# Altium schematic sheet [04] - FPGA - DDR3, DDR3 MEM.SchDoc
size A2; SheetNumber: 4; SheetTotal: 4
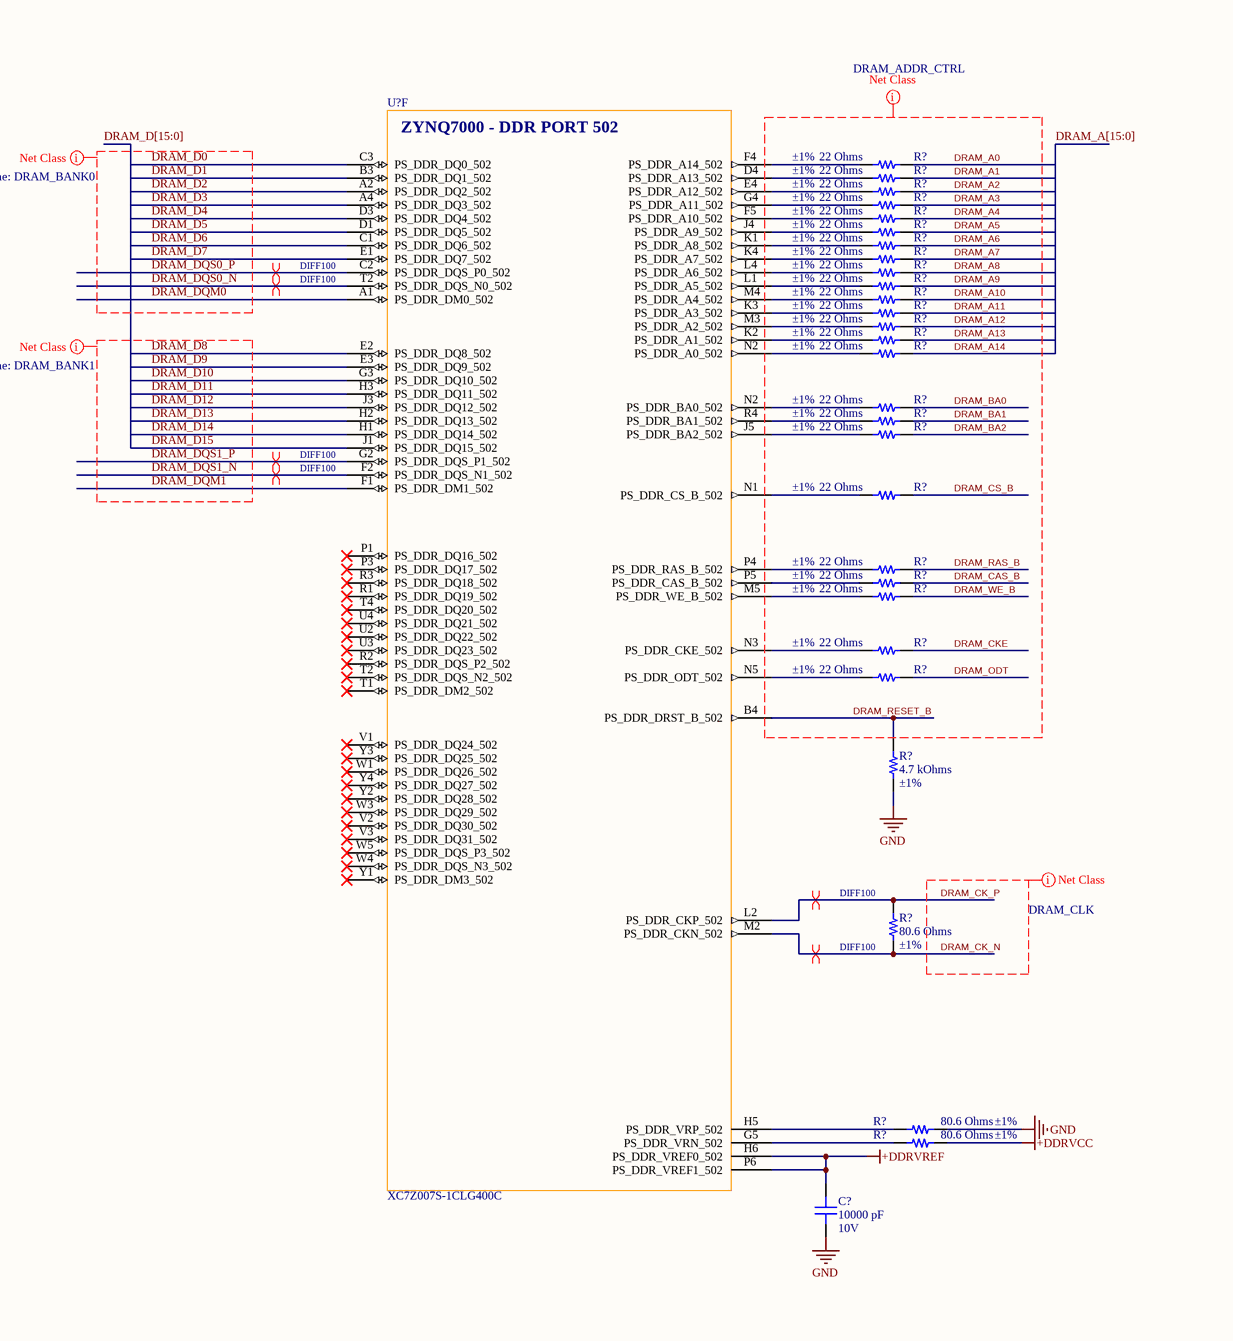
[diagram p0: [04] - FPGA - DDR3, DDR3 MEM.SchDoc, left]
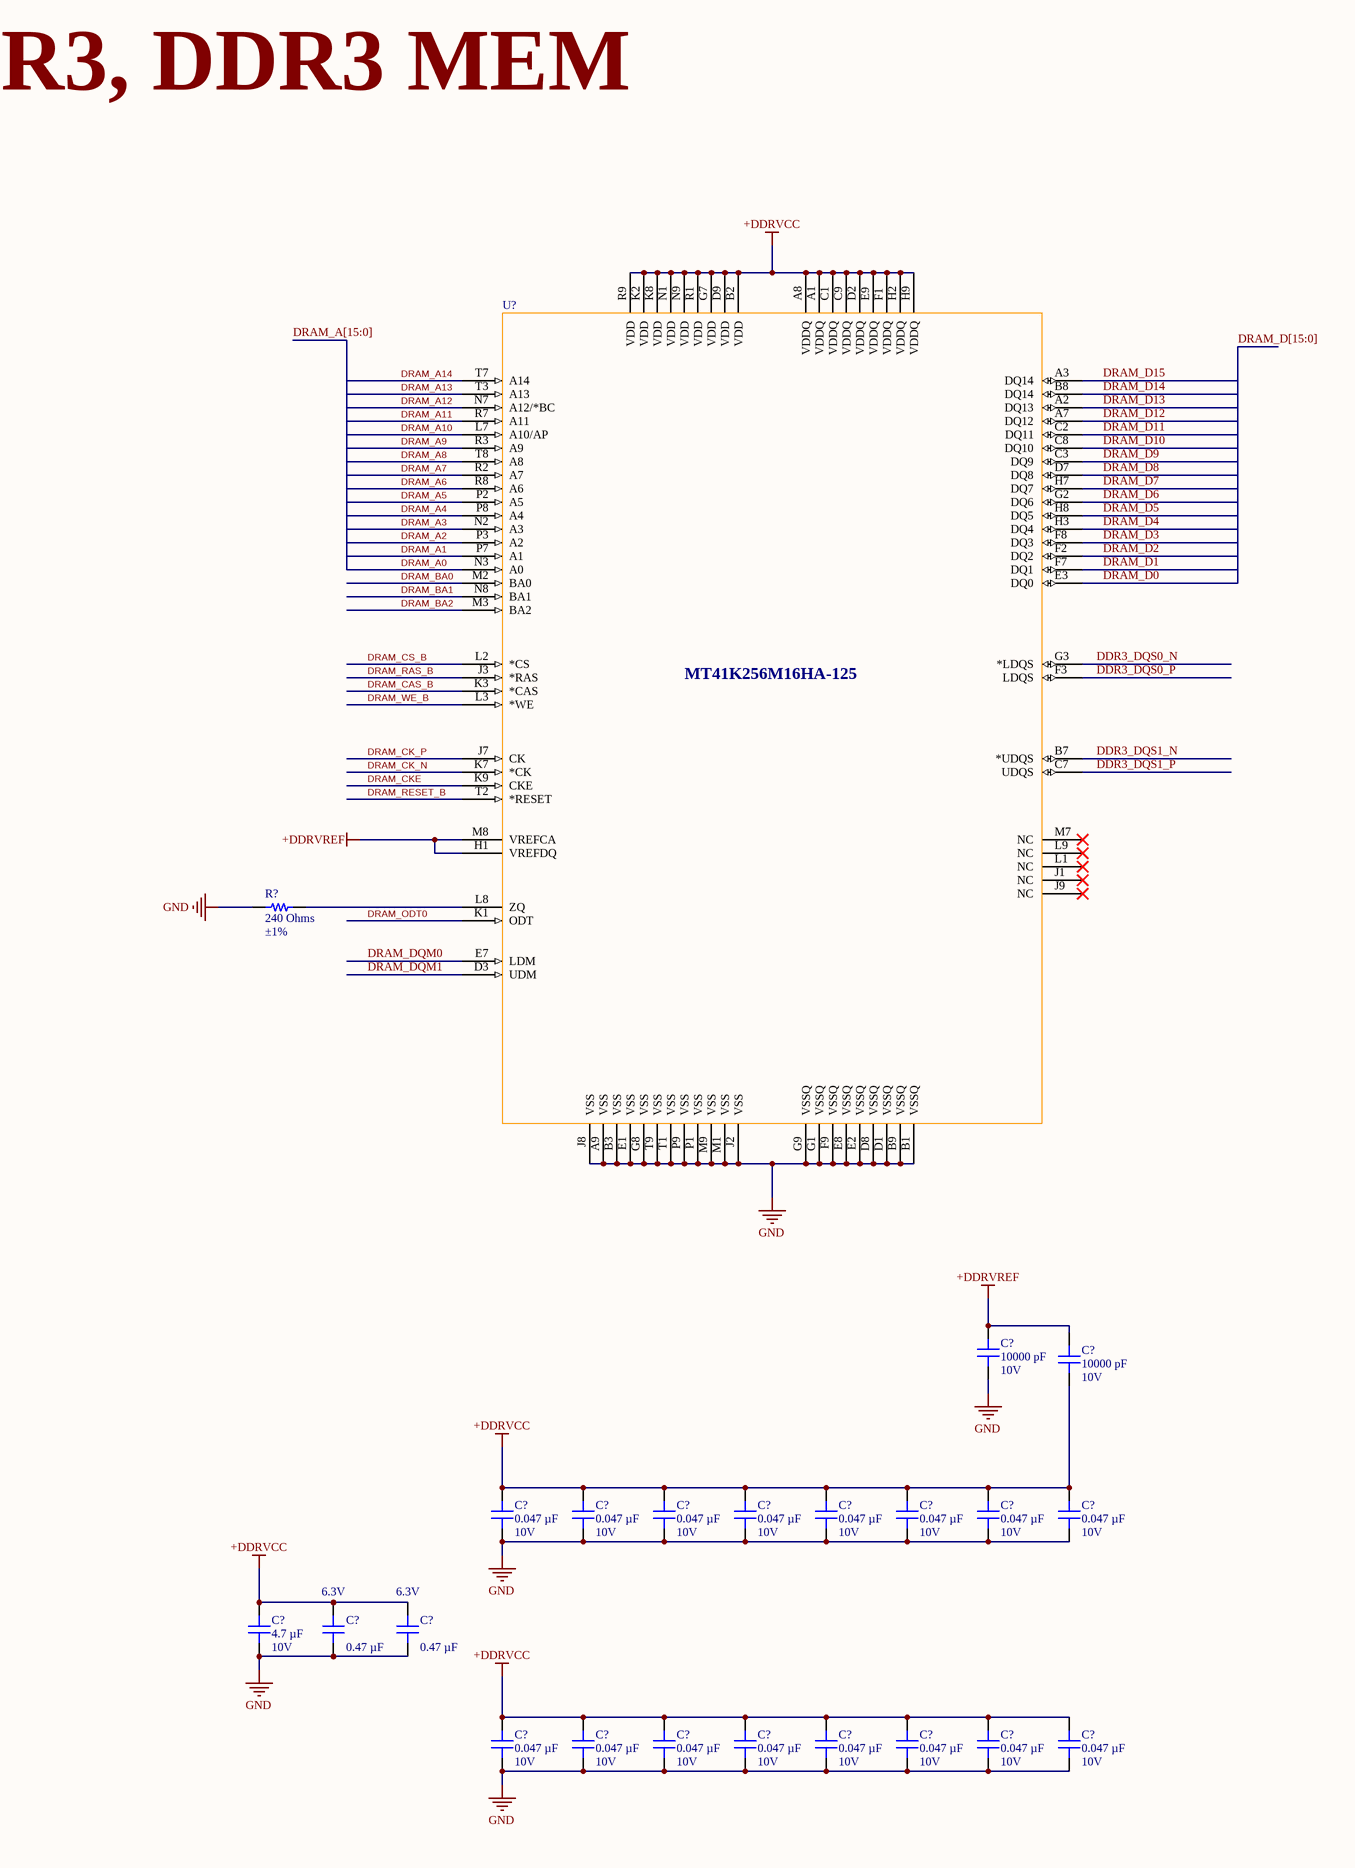
[diagram p1: [04] - FPGA - DDR3, DDR3 MEM.SchDoc, right]

## Parts
(Parts that share a designator on the sheet are numbered #1, #2 ... from top to bottom, then left to right.)
C?#1  Voltage - Rated: 10V  [CAP 0201_0603]  (hidden comment: 10000 pF)
C?#2  Voltage - Rated: 10V  [CAP 0201_0603]  (hidden comment: 10000 pF)
C?#3  Voltage - Rated: 10V  [CAP 0201_0603]  (hidden comment: 10000 pF)
C?#4  Voltage - Rated: 10V  [CAP 0201_0603]  (hidden comment: 0.047 µF)
C?#5  Voltage - Rated: 10V  [CAP 0201_0603]  (hidden comment: 0.047 µF)
C?#6  Voltage - Rated: 10V  [CAP 0201_0603]  (hidden comment: 0.047 µF)
C?#7  Voltage - Rated: 10V  [CAP 0201_0603]  (hidden comment: 0.047 µF)
C?#8  Voltage - Rated: 10V  [CAP 0201_0603]  (hidden comment: 0.047 µF)
C?#9  Voltage - Rated: 10V  [CAP 0201_0603]  (hidden comment: 0.047 µF)
C?#10  Voltage - Rated: 10V  [CAP 0201_0603]  (hidden comment: 0.047 µF)
C?#11  Voltage - Rated: 10V  [CAP 0201_0603]  (hidden comment: 0.047 µF)
C?#12  Voltage - Rated: 10V  [CAP 0402_1005]  (hidden comment: 4.7 µF)
C?#13  Voltage - Rated: 6.3V  [CAP 0201_0603]  (hidden comment: 0.47 µF)
C?#14  Voltage - Rated: 6.3V  [CAP 0201_0603]  (hidden comment: 0.47 µF)
C?#15  Voltage - Rated: 10V  [CAP 0201_0603]  (hidden comment: 0.047 µF)
C?#16  Voltage - Rated: 10V  [CAP 0201_0603]  (hidden comment: 0.047 µF)
C?#17  Voltage - Rated: 10V  [CAP 0201_0603]  (hidden comment: 0.047 µF)
C?#18  Voltage - Rated: 10V  [CAP 0201_0603]  (hidden comment: 0.047 µF)
C?#19  Voltage - Rated: 10V  [CAP 0201_0603]  (hidden comment: 0.047 µF)
C?#20  Voltage - Rated: 10V  [CAP 0201_0603]  (hidden comment: 0.047 µF)
C?#21  Voltage - Rated: 10V  [CAP 0201_0603]  (hidden comment: 0.047 µF)
C?#22  Voltage - Rated: 10V  [CAP 0201_0603]  (hidden comment: 0.047 µF)
R?#1  Tolerance: ±1%  [RES 0201_0603]  (hidden comment: 22 Ohms)
R?#2  Tolerance: ±1%  [RES 0201_0603]  (hidden comment: 22 Ohms)
R?#3  Tolerance: ±1%  [RES 0201_0603]  (hidden comment: 22 Ohms)
R?#4  Tolerance: ±1%  [RES 0201_0603]  (hidden comment: 22 Ohms)
R?#5  Tolerance: ±1%  [RES 0201_0603]  (hidden comment: 22 Ohms)
R?#6  Tolerance: ±1%  [RES 0201_0603]  (hidden comment: 22 Ohms)
R?#7  Tolerance: ±1%  [RES 0201_0603]  (hidden comment: 22 Ohms)
R?#8  Tolerance: ±1%  [RES 0201_0603]  (hidden comment: 22 Ohms)
R?#9  Tolerance: ±1%  [RES 0201_0603]  (hidden comment: 22 Ohms)
R?#10  Tolerance: ±1%  [RES 0201_0603]  (hidden comment: 22 Ohms)
R?#11  Tolerance: ±1%  [RES 0201_0603]  (hidden comment: 22 Ohms)
R?#12  Tolerance: ±1%  [RES 0201_0603]  (hidden comment: 22 Ohms)
R?#13  Tolerance: ±1%  [RES 0201_0603]  (hidden comment: 22 Ohms)
R?#14  Tolerance: ±1%  [RES 0201_0603]  (hidden comment: 22 Ohms)
R?#15  Tolerance: ±1%  [RES 0201_0603]  (hidden comment: 22 Ohms)
R?#16  Tolerance: ±1%  [RES 0201_0603]  (hidden comment: 22 Ohms)
R?#17  Tolerance: ±1%  [RES 0201_0603]  (hidden comment: 22 Ohms)
R?#18  Tolerance: ±1%  [RES 0201_0603]  (hidden comment: 22 Ohms)
R?#19  Tolerance: ±1%  [RES 0201_0603]  (hidden comment: 22 Ohms)
R?#20  Tolerance: ±1%  [RES 0201_0603]  (hidden comment: 22 Ohms)
R?#21  Tolerance: ±1%  [RES 0201_0603]  (hidden comment: 22 Ohms)
R?#22  Tolerance: ±1%  [RES 0201_0603]  (hidden comment: 22 Ohms)
R?#23  Tolerance: ±1%  [RES 0201_0603]  (hidden comment: 22 Ohms)
R?#24  Tolerance: ±1%  [RES 0201_0603]  (hidden comment: 22 Ohms)
R?#25  Tolerance: ±1%  [RES 0402_1005]  (hidden comment: 240 Ohms)
R?#26  Tolerance: ±1%  [RES 0402_1005]  (hidden comment: 4.7 kOhms)
R?#27  Tolerance: ±1%  [RES 0402_1005]  (hidden comment: 80.6 Ohms)
R?#28  Tolerance: ±1%  [RES 0402_1005]  (hidden comment: 80.6 Ohms)
R?#29  Tolerance: ±1%  [RES 0402_1005]  (hidden comment: 80.6 Ohms)
U?#1  XC7Z007S-1CLG400C  [CLG400_XIL]  (part F of 8)
U?#2  MT41K256M16HA-125

## Nets
+DDRVCC: C?#2.1 C?#4.2 C?#5.2 C?#6.2 C?#7.2 C?#8.2 C?#9.2 C?#10.2 C?#11.2 C?#12.2 C?#13.2 C?#14.2 C?#15.2 C?#16.2 C?#17.2 C?#18.2 C?#19.2 C?#20.2 C?#21.2 C?#22.2 R?#29.2 U?#2.A1(VDDQ) U?#2.A8(VDDQ) U?#2.B2(VDD) U?#2.C1(VDDQ) U?#2.C9(VDDQ) U?#2.D2(VDDQ) U?#2.D9(VDD) U?#2.E9(VDDQ) U?#2.F1(VDDQ) U?#2.G7(VDD) U?#2.H2(VDDQ) U?#2.H9(VDDQ) U?#2.K2(VDD) U?#2.K8(VDD) U?#2.N1(VDD) U?#2.N9(VDD) U?#2.R1(VDD) U?#2.R9(VDD)
+DDRVREF: C?#1.2 C?#2.2 C?#3.2 U?#1.H6(PS_DDR_VREF0_502) U?#1.P6(PS_DDR_VREF1_502) U?#2.H1(VREFDQ) U?#2.M8(VREFCA)
GND: C?#1.1 C?#3.1 C?#4.1 C?#5.1 C?#6.1 C?#7.1 C?#8.1 C?#9.1 C?#10.1 C?#11.1 C?#12.1 C?#13.1 C?#14.1 C?#15.1 C?#16.1 C?#17.1 C?#18.1 C?#19.1 C?#20.1 C?#21.1 C?#22.1 R?#25.1 R?#26.2 R?#28.2 U?#2.A9(VSS) U?#2.B1(VSSQ) U?#2.B3(VSS) U?#2.B9(VSSQ) U?#2.D1(VSSQ) U?#2.D8(VSSQ) U?#2.E1(VSS) U?#2.E2(VSSQ) U?#2.E8(VSSQ) U?#2.F9(VSSQ) U?#2.G1(VSSQ) U?#2.G8(VSS) U?#2.G9(VSSQ) U?#2.J2(VSS) U?#2.J8(VSS) U?#2.M1(VSS) U?#2.M9(VSS) U?#2.P1(VSS) U?#2.P9(VSS) U?#2.T1(VSS) U?#2.T9(VSS)
DDR3_DQS0_N: U?#2.G3(*LDQS)
DDR3_DQS0_P: U?#2.F3(LDQS)
DDR3_DQS1_N: U?#2.B7(*UDQS)
DDR3_DQS1_P: U?#2.C7(UDQS)
DRAM_A0: R?#1.1 U?#2.N3(A0)
DRAM_A1: R?#2.1 U?#2.P7(A1)
DRAM_A2: R?#3.1 U?#2.P3(A2)
DRAM_A3: R?#4.1 U?#2.N2(A3)
DRAM_A4: R?#5.1 U?#2.P8(A4)
DRAM_A5: R?#6.1 U?#2.P2(A5)
DRAM_A6: R?#7.1 U?#2.R8(A6)
DRAM_A7: R?#8.1 U?#2.R2(A7)
DRAM_A8: R?#9.1 U?#2.T8(A8)
DRAM_A9: R?#10.1 U?#2.R3(A9)
DRAM_A10: R?#11.1 U?#2.L7(A10/AP)
DRAM_A11: R?#12.1 U?#2.R7(A11)
DRAM_A12: R?#13.1 U?#2.N7(A12/*BC)
DRAM_A13: R?#14.1 U?#2.T3(A13)
DRAM_A14: R?#15.1 U?#2.T7(A14)
DRAM_BA0: R?#16.1 U?#2.M2(BA0)
DRAM_BA1: R?#17.1 U?#2.N8(BA1)
DRAM_BA2: R?#18.1 U?#2.M3(BA2)
DRAM_CAS_B: R?#21.1 U?#2.K3(*CAS)
DRAM_CK_N: R?#27.2 U?#1.M2(PS_DDR_CKN_502) U?#2.K7(*CK)
DRAM_CK_P: R?#27.1 U?#1.L2(PS_DDR_CKP_502) U?#2.J7(CK)
DRAM_CKE: R?#23.1 U?#2.K9(CKE)
DRAM_CS_B: R?#19.1 U?#2.L2(*CS)
DRAM_D0: U?#1.C3(PS_DDR_DQ0_502) U?#2.E3(DQ0)
DRAM_D1: U?#1.B3(PS_DDR_DQ1_502) U?#2.F7(DQ1)
DRAM_D2: U?#1.A2(PS_DDR_DQ2_502) U?#2.F2(DQ2)
DRAM_D3: U?#1.A4(PS_DDR_DQ3_502) U?#2.F8(DQ3)
DRAM_D4: U?#1.D3(PS_DDR_DQ4_502) U?#2.H3(DQ4)
DRAM_D5: U?#1.D1(PS_DDR_DQ5_502) U?#2.H8(DQ5)
DRAM_D6: U?#1.C1(PS_DDR_DQ6_502) U?#2.G2(DQ6)
DRAM_D7: U?#1.E1(PS_DDR_DQ7_502) U?#2.H7(DQ7)
DRAM_D8: U?#1.E2(PS_DDR_DQ8_502) U?#2.D7(DQ8)
DRAM_D9: U?#1.E3(PS_DDR_DQ9_502) U?#2.C3(DQ9)
DRAM_D10: U?#1.G3(PS_DDR_DQ10_502) U?#2.C8(DQ10)
DRAM_D11: U?#1.H3(PS_DDR_DQ11_502) U?#2.C2(DQ11)
DRAM_D12: U?#1.J3(PS_DDR_DQ12_502) U?#2.A7(DQ12)
DRAM_D13: U?#1.H2(PS_DDR_DQ13_502) U?#2.A2(DQ13)
DRAM_D14: U?#1.H1(PS_DDR_DQ14_502) U?#2.B8(DQ14)
DRAM_D15: U?#1.J1(PS_DDR_DQ15_502) U?#2.A3(DQ14)
DRAM_DQM0: U?#1.A1(PS_DDR_DM0_502) U?#2.E7(LDM)
DRAM_DQM1: U?#1.F1(PS_DDR_DM1_502) U?#2.D3(UDM)
DRAM_DQS0_N: U?#1.T2(PS_DDR_DQS_N2_502)
DRAM_DQS0_P: U?#1.C2(PS_DDR_DQS_P0_502)
DRAM_DQS1_N: U?#1.F2(PS_DDR_DQS_N1_502)
DRAM_DQS1_P: U?#1.G2(PS_DDR_DQS_P1_502)
DRAM_ODT: R?#24.1
DRAM_ODT0: U?#2.K1(ODT)
DRAM_RAS_B: R?#20.1 U?#2.J3(*RAS)
DRAM_RESET_B: R?#26.1 U?#1.B4(PS_DDR_DRST_B_502) U?#2.T2(*RESET)
DRAM_WE_B: R?#22.1 U?#2.L3(*WE)
NetR?#1_2: R?#1.2 U?#1.F4(PS_DDR_A14_502)
NetR?#2_2: R?#2.2 U?#1.D4(PS_DDR_A13_502)
NetR?#3_2: R?#3.2 U?#1.E4(PS_DDR_A12_502)
NetR?#4_2: R?#4.2 U?#1.G4(PS_DDR_A11_502)
NetR?#5_2: R?#5.2 U?#1.F5(PS_DDR_A10_502)
NetR?#6_2: R?#6.2 U?#1.J4(PS_DDR_A9_502)
NetR?#7_2: R?#7.2 U?#1.K1(PS_DDR_A8_502)
NetR?#8_2: R?#8.2 U?#1.K4(PS_DDR_A7_502)
NetR?#9_2: R?#9.2 U?#1.L4(PS_DDR_A6_502)
NetR?#10_2: R?#10.2 U?#1.L1(PS_DDR_A5_502)
NetR?#11_2: R?#11.2 U?#1.M4(PS_DDR_A4_502)
NetR?#12_2: R?#12.2 U?#1.K3(PS_DDR_A3_502)
NetR?#13_2: R?#13.2 U?#1.M3(PS_DDR_A2_502)
NetR?#14_2: R?#14.2 U?#1.K2(PS_DDR_A1_502)
NetR?#15_2: R?#15.2 U?#1.N2(PS_DDR_A0_502)
NetR?#16_2: R?#16.2 U?#1.N2(PS_DDR_BA0_502)
NetR?#17_2: R?#17.2 U?#1.R4(PS_DDR_BA1_502)
NetR?#18_2: R?#18.2 U?#1.J5(PS_DDR_BA2_502)
NetR?#19_2: R?#19.2 U?#1.N1(PS_DDR_CS_B_502)
NetR?#20_2: R?#20.2 U?#1.P4(PS_DDR_RAS_B_502)
NetR?#21_2: R?#21.2 U?#1.P5(PS_DDR_CAS_B_502)
NetR?#22_2: R?#22.2 U?#1.M5(PS_DDR_WE_B_502)
NetR?#23_2: R?#23.2 U?#1.N3(PS_DDR_CKE_502)
NetR?#24_2: R?#24.2 U?#1.N5(PS_DDR_ODT_502)
NetR?#25_2: R?#25.2 U?#2.L8(ZQ)
NetR?#28_1: R?#28.1 U?#1.H5(PS_DDR_VRP_502)
NetR?#29_1: R?#29.1 U?#1.G5(PS_DDR_VRN_502)

Not connected (* = marked no-connect by the designer): U?#1 P1(PS_DDR_DQ16_502)* P3(PS_DDR_DQ17_502)* R1(PS_DDR_DQ19_502)* R2(PS_DDR_DQS_P2_502)* R3(PS_DDR_DQ18_502)* T1(PS_DDR_DM2_502)* T4(PS_DDR_DQ20_502)* U2(PS_DDR_DQ22_502)* U3(PS_DDR_DQ23_502)* U4(PS_DDR_DQ21_502)* V1(PS_DDR_DQ24_502)* V2(PS_DDR_DQ30_502)* V3(PS_DDR_DQ31_502)* W1(PS_DDR_DQ26_502)* W3(PS_DDR_DQ29_502)* W4(PS_DDR_DQS_N3_502)* W5(PS_DDR_DQS_P3_502)* Y1(PS_DDR_DM3_502)* Y2(PS_DDR_DQ28_502)* Y3(PS_DDR_DQ25_502)* Y4(PS_DDR_DQ27_502)*; U?#2 J1(NC)* J9(NC)* L1(NC)* L9(NC)* M7(NC)*

## Buses and harness runs
bus DRAM_A[15:0]
bus DRAM_D[15:0]

## Layout directives
Net Class Name: DRAM_ADDR_CTRL: DRAM_A0, DRAM_A1, DRAM_A2, DRAM_A3, DRAM_A4, DRAM_A5, DRAM_A6, DRAM_A7, DRAM_A8, DRAM_A9, DRAM_A10, DRAM_A11, DRAM_A12, DRAM_A13, DRAM_A14, DRAM_BA0, DRAM_BA1, DRAM_BA2, DRAM_CAS_B, DRAM_CKE, DRAM_CS_B, DRAM_ODT, DRAM_RAS_B, DRAM_RESET_B, DRAM_WE_B
Net Class Name: DRAM_BANK0: DRAM_D0, DRAM_D1, DRAM_D2, DRAM_D3, DRAM_D4, DRAM_D5, DRAM_D6, DRAM_D7, DRAM_DQM0, DRAM_DQS0_N, DRAM_DQS0_P
Net Class Name: DRAM_BANK1: DRAM_D8, DRAM_D9, DRAM_D10, DRAM_D11, DRAM_D12, DRAM_D13, DRAM_D14, DRAM_D15, DRAM_DQM1, DRAM_DQS1_N, DRAM_DQS1_P
differential pair; net class DIFF100: DRAM_CK_N, DRAM_CK_P, DRAM_DQS0_N, DRAM_DQS0_P, DRAM_DQS1_N, DRAM_DQS1_P
Net Class Name: DRAM_CLK: DRAM_CK_N, DRAM_CK_P

## Notes on the sheet
- FPGA - DDR3, DDR3 MEM
- (in symbol XC7Z007S-1CLG400C, part F) ZYNQ7000 - DDR PORT 502

## Library data of the parts
C?#1-C?#3 = MAASL063SB7103MFCA01: CAP CER 0.01UF 10V X7R 0201; manufacturer: Taiyo Yuden; Tolerance: ±20%; Part Number: MAASL063SB7103MFCA01; Value: 10000 pF; Applications: Automotive; Capacitance: 10000 pF; componentlink1description: Datasheet; componentlink1url: https://media.digikey.com/pdf/Data%20Sheets/Taiyo%20Yuden%20PDFs%20URL%20links/MAASL063SB7103MFCA01_SS.pdf; componentlink2description: DigiKey Link; componentlink2url: https://www.digikey.com/en/products/detail/taiyo-yuden/MAASL063SB7103MFCA01/18109005; Device Package: 0201 (0603 Metric); Height - Seated (Max): 0.013" (0.33mm); lastupdated: 27.04.2023 19:00:59; Lifecycle Status: Active; Minimum Order: 1; Mounting Type: Surface Mount, MLCC; Operating Temperature: -55°C ~ 125°C; Package / Case: 0201 (0603 Metric); packaging: TapeAndReel; partid: 47946; Part Status: Active; price: 0.01; Ratings: AEC-Q200; series: MAAS; Size / Dimension: 0.024" L x 0.012" W (0.60mm x 0.30mm); Supplier 1: DigiKey; Supplier Part Number 1: 587-MAASL063SB7103MFCA01CT-ND; Temperature Coefficient: X7R; Thickness (Max): 0.013" (0.33mm)
C?#4-C?#11 C?#15-C?#22 = LMK063BJ473KP-F: CAP CER 0.047UF 10V X5R 0201; manufacturer: Taiyo Yuden; Tolerance: ±10%; Part Number: LMK063BJ473KP-F; Value: 0.047 µF; Applications: SMPS Filtering; Capacitance: 0.047 µF; componentlink1description: Datasheet; componentlink1url: https://ds.yuden.co.jp/TYCOMPAS/ut/detail?pn=LMK063BJ473KP-F  &u=M; componentlink2description: DigiKey Link; componentlink2url: https://www.digikey.com/en/products/detail/taiyo-yuden/LMK063BJ473KP-F/2002857; Device Package: 0201 (0603 Metric); lastupdated: 27.04.2023 19:01:19; Lifecycle Status: Active; Minimum Order: 1; Mounting Type: Surface Mount, MLCC; Operating Temperature: -55°C ~ 85°C; Package / Case: 0201 (0603 Metric); packaging: TapeAndReel; partid: 223; Part Status: Active; price: 0.01; series: M; Size / Dimension: 0.024" L x 0.012" W (0.60mm x 0.30mm); Supplier 1: DigiKey; Supplier Part Number 1: 587-2242-1-ND; Temperature Coefficient: X5R; Thickness (Max): 0.013" (0.33mm)
C?#12 = GMC04X5R475K10NT: CAP0402 X5R 4.7UF 10% 10V; manufacturer: Cal-Chip Electronics, Inc.; Part Number: GMC04X5R475K10NT; Value: 4.7 µF; Applications: General Purpose; Capacitance: 4.7 µF; componentlink1description: Datasheet; componentlink1url: https://88ce57.p3cdn1.secureserver.net/wp-content/uploads/2023/01/gmc_series-2.pdf; componentlink2description: DigiKey Link; componentlink2url: https://www.digikey.com/en/products/detail/cal-chip-electronics-inc/GMC04X5R475K10NT/18151135; Device Package: 0402 (1005 Metric); lastupdated: 26.04.2023 19:01:59; Lifecycle Status: Active; Minimum Order: 1; Mounting Type: Surface Mount, MLCC; Operating Temperature: -55°C ~ 85°C; Package / Case: 0402 (1005 Metric); packaging: TapeAndReel; partid: 49814; Part Status: Active; price: 0.01; series: GMC; Size / Dimension: 0.039" L x 0.020" W (1.00mm x 0.50mm); Supplier 1: DigiKey; Supplier Part Number 1: 4713-GMC04X5R475K10NTCT-ND; Temperature Coefficient: X5R; Thickness (Max): 0.028" (0.70mm); Tolerance: ±10%
C?#13 C?#14 = JMK063BC6474KP-F: CAP CER 0.47UF 6.3V X6S 0201; manufacturer: Taiyo Yuden; Tolerance: ±10%; Part Number: JMK063BC6474KP-F; Value: 0.47 µF; Applications: SMPS Filtering; Capacitance: 0.47 µF; componentlink1description: Datasheet; componentlink1url: https://ds.yuden.co.jp/TYCOMPAS/ut/detail?pn=JMK063BC6474KP-F&u=M; componentlink2description: DigiKey Link; componentlink2url: https://www.digikey.com/en/products/detail/taiyo-yuden/JMK063BC6474KP-F/9947925; Device Package: 0201 (0603 Metric); lastupdated: 26.04.2023 19:00:46; Lifecycle Status: Active; Minimum Order: 1; Mounting Type: Surface Mount, MLCC; Operating Temperature: -55°C ~ 105°C; Package / Case: 0201 (0603 Metric); packaging: TapeAndReel; partid: 108; Part Status: Active; price: 0.01; series: M; Size / Dimension: 0.024" L x 0.012" W (0.60mm x 0.30mm); Supplier 1: DigiKey; Supplier Part Number 1: 587-6386-1-ND; Temperature Coefficient: X6S; Thickness (Max): 0.015" (0.39mm)
R?#1-R?#24 = ERJ-1GNF22R0C: RES SMD 22 OHM 1% 1/20W 0201; Manufacturer: Panasonic Electronic Components; Power (Watts): 0.05W, 1/20W; Temperature Coefficient: ±200ppm/°C; Part Number: ERJ-1GNF22R0C; Value: 22 Ohms; ComponentLink1Description: Datasheet; ComponentLink1URL: https://industrial.panasonic.com/cdbs/www-data/pdf/RDA0000/AOA0000C304.pdf; ComponentLink2Description: DigiKey Link; ComponentLink2URL: https://www.digikey.com/en/products/detail/panasonic-electronic-components/ERJ-1GNF22R0C/2035920; Composition: Thick Film; Device Package: 0201 (0603 Metric); Features: Automotive AEC-Q200; Height - Seated (Max): 0.010" (0.26mm); LastUpdated: 29.04.2023 19:19:39; Lifecycle Status: Active; Minimum Order: 1; Number of Terminations: 2; Operating Temperature: -55°C ~ 125°C; Package / Case: 0201 (0603 Metric); Packaging: TapeAndReel; PartId: 823; Part Status: Active; Price: 0.01; Ratings: AEC-Q200; Resistance: 22 Ohms; Series: ERJ-1GN; Size / Dimension: 0.024" L x 0.012" W (0.60mm x 0.30mm); Supplier 1: DigiKey; Supplier Part Number 1: P122843CT-ND; Supplier Device Package: 0201
R?#25 = RMCF0402FT240R: RES 240 OHM 1% 1/16W 0402; Manufacturer: Stackpole Electronics Inc; Power (Watts): 0.063W, 1/16W; Temperature Coefficient: ±100ppm/°C; Part Number: RMCF0402FT240R; Value: 240 Ohms; ComponentLink1Description: Datasheet; ComponentLink1URL: https://www.seielect.com/catalog/sei-rmcf_rmcp.pdf; ComponentLink2Description: DigiKey Link; ComponentLink2URL: https://www.digikey.com/en/products/detail/stackpole-electronics-inc/RMCF0402FT240R/2417437; Composition: Thick Film; Device Package: 0402 (1005 Metric); Features: Automotive AEC-Q200; Height - Seated (Max): 0.016" (0.40mm); LastUpdated: 1.05.2023 19:23:08; Lifecycle Status: Active; Minimum Order: 1; Number of Terminations: 2; Operating Temperature: -55°C ~ 155°C; Package / Case: 0402 (1005 Metric); Packaging: CutTape; PartId: 4938; Part Status: Active; Price: 0.01; Ratings: AEC-Q200; Resistance: 240 Ohms; Series: RMCF; Size / Dimension: 0.039" L x 0.020" W (1.00mm x 0.50mm); Supplier 1: DigiKey; Supplier Part Number 1: RMCF0402FT240RCT-ND; Supplier Device Package: 0402
R?#26 = RT0402FRE074K7L: RES SMD 4.7K OHM 1% 1/16W 0402; Manufacturer: Yageo; Power (Watts): 0.063W, 1/16W; Temperature Coefficient: ±50ppm/°C; Part Number: RT0402FRE074K7L; Value: 4.7 kOhms; ComponentLink1Description: Datasheet; ComponentLink1URL: https://www.yageo.com/upload/media/product/productsearch/datasheet/rchip/PYu-RT_1-to-0.01_RoHS_L_11.pdf; ComponentLink2Description: DigiKey Link; ComponentLink2URL: https://www.digikey.com/en/products/detail/yageo/RT0402FRE074K7L/1072052; Composition: Thin Film; Device Package: 0402 (1005 Metric); Height - Seated (Max): 0.014" (0.35mm); LastUpdated: 1.05.2023 19:23:11; Lifecycle Status: Active; Minimum Order: 1; Number of Terminations: 2; Operating Temperature: -55°C ~ 155°C; Package / Case: 0402 (1005 Metric); Packaging: TapeAndReel; PartId: 3198; Part Status: Active; Price: 0.01; Resistance: 4.7 kOhms; Series: RT; Size / Dimension: 0.039" L x 0.020" W (1.00mm x 0.50mm); Supplier 1: DigiKey; Supplier Part Number 1: YAG3347CT-ND; Supplier Device Package: 0402
R?#27-R?#29 = CRCW040280R6FKED: RES SMD 80.6 OHM 1% 1/16W 0402; Manufacturer: Vishay Dale; Power (Watts): 0.063W, 1/16W; Temperature Coefficient: ±100ppm/°C; Part Number: CRCW040280R6FKED; Value: 80.6 Ohms; ComponentLink1Description: Datasheet; ComponentLink1URL: http://www.vishay.com/docs/20035/dcrcwe3.pdf; ComponentLink2Description: DigiKey Link; ComponentLink2URL: https://www.digikey.com/en/products/detail/vishay-dale/CRCW040280R6FKED/1177882; Composition: Thick Film; Device Package: 0402 (1005 Metric); Features: Automotive AEC-Q200; Height - Seated (Max): 0.016" (0.40mm); LastUpdated: 1.05.2023 19:23:04; Lifecycle Status: Active; Minimum Order: 1; Number of Terminations: 2; Operating Temperature: -55°C ~ 155°C; Package / Case: 0402 (1005 Metric); Packaging: CutTape; PartId: 7140; Part Status: Active; Price: 0.01; Ratings: AEC-Q200; Resistance: 80.6 Ohms; Series: CRCW; Size / Dimension: 0.039" L x 0.020" W (1.00mm x 0.50mm); Supplier 1: DigiKey; Supplier Part Number 1: 541-80.6LCT-ND; Supplier Device Package: 0402
U?#1 = XC7Z007S-1CLG400C: No Description Available; Mfr_Name: Xilinx Inc; RefDes: RefDes; Type: Type